# EAGLE design AntennaBoard (EAGLE 6.1)
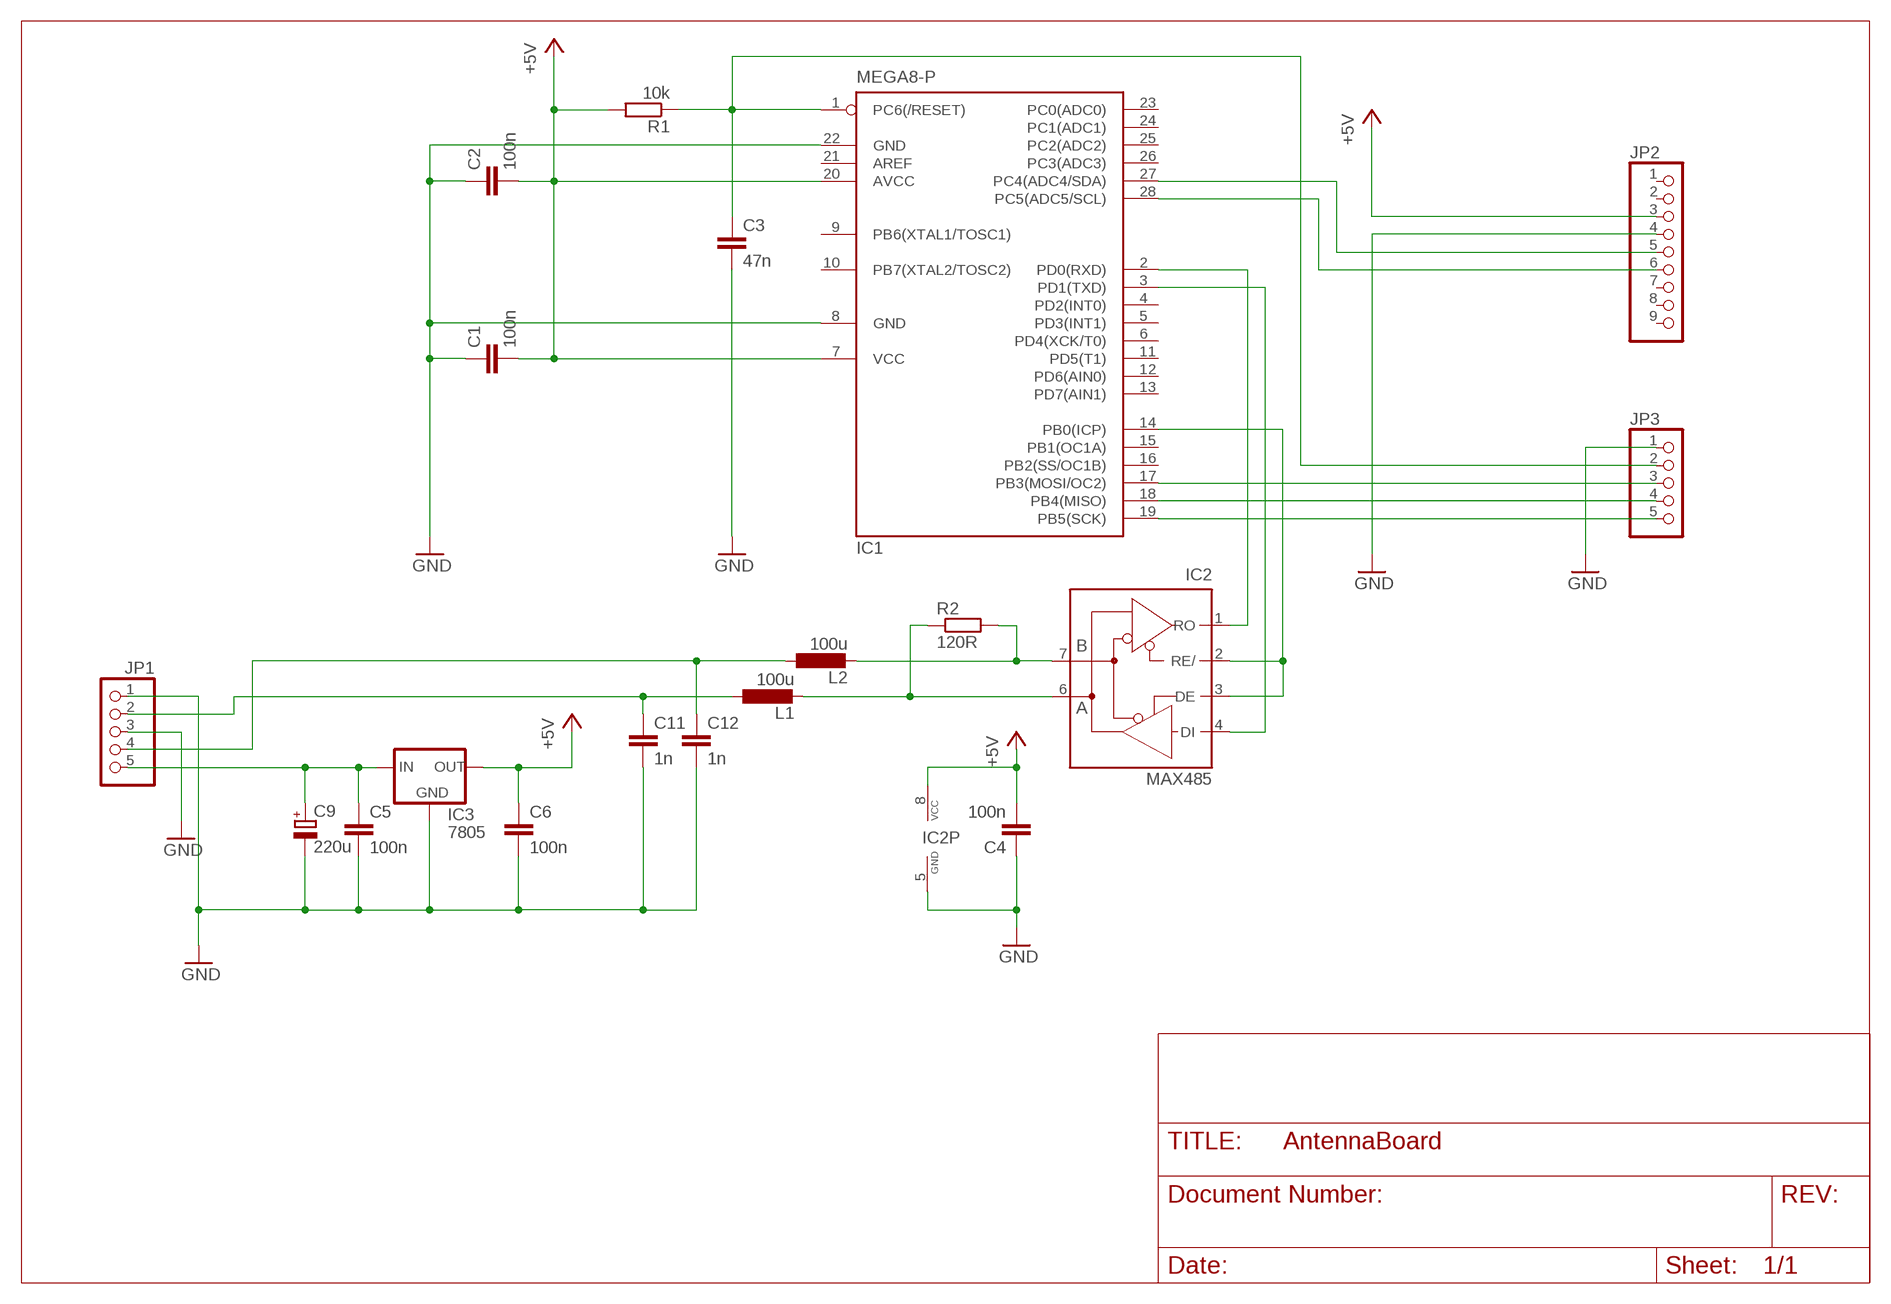
[diagram p0: schematic, sheet 1]

## Parts
C1  100n  C-EU050-024X044  [C050-024X044]
C2  100n  C-EU050-024X044  [C050-024X044]
C3  47n  C-EU050-024X044  [C050-024X044]
C4  100n  C-EU050-024X044  [C050-024X044]
C5  100n  C-EU050-024X044  [C050-024X044]
C6  100n  C-EU050-024X044  [C050-024X044]
C9  220u  CPOL-EUE5-10.5  [E5-10,5]
C11  1n  C-EU025-024X044  [C025-024X044]
C12  1n  C-EU025-024X044  [C025-024X044]
IC1  MEGA8-P  [DIL28-3]
IC2  MAX485  MAX481CPA  [DIL08]
IC3  7805  78XXL  [78XXL]
JP1  PINHD-1X5/90  [1X05/90]
JP2  PINHD-1X9  [1X09]
JP3  PINHD-1X5  [1X05]
L1  100u  L-EU0207/12  [0207/12]
L2  100u  L-EU0207/12  [0207/12]
R1  10k  R-EU_0207/10  [0207/10]
R2  120R  R-EU_0207/10  [0207/10]

## Nets
+5V: C1.2 C2.2 C4.2 C6.1 IC1.7(VCC) IC1.20(AVCC) IC2.8(VCC) IC3.OUT JP2.3 R1.2
GND: C1.1 C2.1 C3.2 C4.1 C5.2 C6.2 C9.- C11.2 C12.2 IC1.8(GND) IC1.22(GND) IC2.5(GND) IC3.GND JP1.1 JP1.3 JP2.4 JP3.1
N$1: C5.1 C9.+ IC3.IN JP1.5
N$2: IC2.6(A) L1.2 R2.1
N$3: C12.1 JP1.4 L2.1
N$4: IC1.28(PC5(ADC5/SCL)) JP2.6
N$5: C3.1 IC1.1(PC6(/RESET)) JP3.2 R1.1
N$6: IC1.27(PC4(ADC4/SDA)) JP2.5
N$7: IC1.14(PB0(ICP)) IC2.2(RE/) IC2.3(DE)
N$8: IC1.2(PD0(RXD)) IC2.1(RO)
N$9: IC1.3(PD1(TXD)) IC2.4(DI)
N$10: IC2.7(B) L2.2 R2.2
N$11: C11.1 JP1.2 L1.1
N$13: IC1.17(PB3(MOSI/OC2)) JP3.3
N$14: IC1.18(PB4(MISO)) JP3.4
N$15: IC1.19(PB5(SCK)) JP3.5
Unconnected: IC1.4(PD2(INT0)) IC1.5(PD3(INT1)) IC1.6(PD4(XCK/T0)) IC1.9(PB6(XTAL1/TOSC1)) IC1.10(PB7(XTAL2/TOSC2)) IC1.11(PD5(T1)) IC1.12(PD6(AIN0)) IC1.13(PD7(AIN1)) IC1.15(PB1(OC1A)) IC1.16(PB2(SS/OC1B)) IC1.21(AREF) IC1.23(PC0(ADC0)) IC1.24(PC1(ADC1)) IC1.25(PC2(ADC2)) IC1.26(PC3(ADC3)) JP2.1 JP2.2 JP2.7 JP2.8 JP2.9

## Library data of the parts
C1-C6 C11 C12 = rcl:C-EU: CAPACITOR, European symbol
C9 = rcl:CPOL-EU: POLARIZED CAPACITOR, European symbol
IC1 = atmel:MEGA8-P: MICROCONTROLLER 8 Kbytes FLASH, 1 kbytes SRAM, 512 bytes EEPROM, USART, 4-channel 10 bit ADC, 2-channel 8 bit ADC Pin compatible with Atmega48, ATMega88, ATMega168 Source: avr.lbr; OC_FARNELL: unknown; OC_NEWARK: unknown
IC2 = maxim:MAX481CPA: RS485 TRANSEIVER; MPN: MAX481CPA+; OC_FARNELL: unknown; OC_NEWARK: 99K3445
IC3 = v-reg:78XXL: VOLTAGE REGULATOR
JP1 JP3 = pinhead:PINHD-1X5: PIN HEADER
JP2 = pinhead:PINHD-1X9: PIN HEADER
L1 L2 = rcl:L-EU: INDUCTOR, European symbol
R1 R2 = rcl:R-EU_: RESISTOR, European symbol

## Board
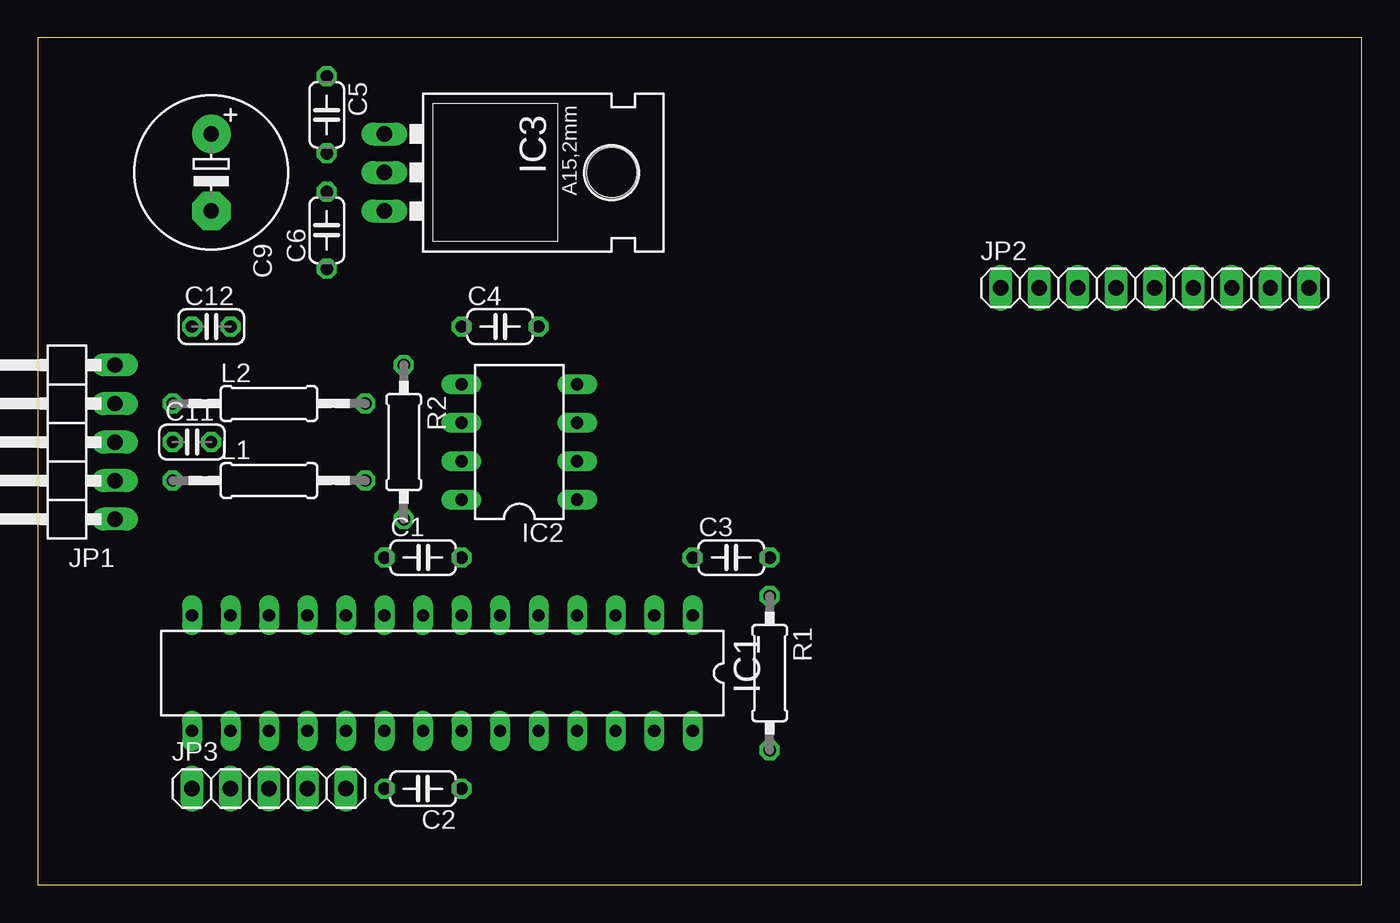
[diagram p1: board, top side]
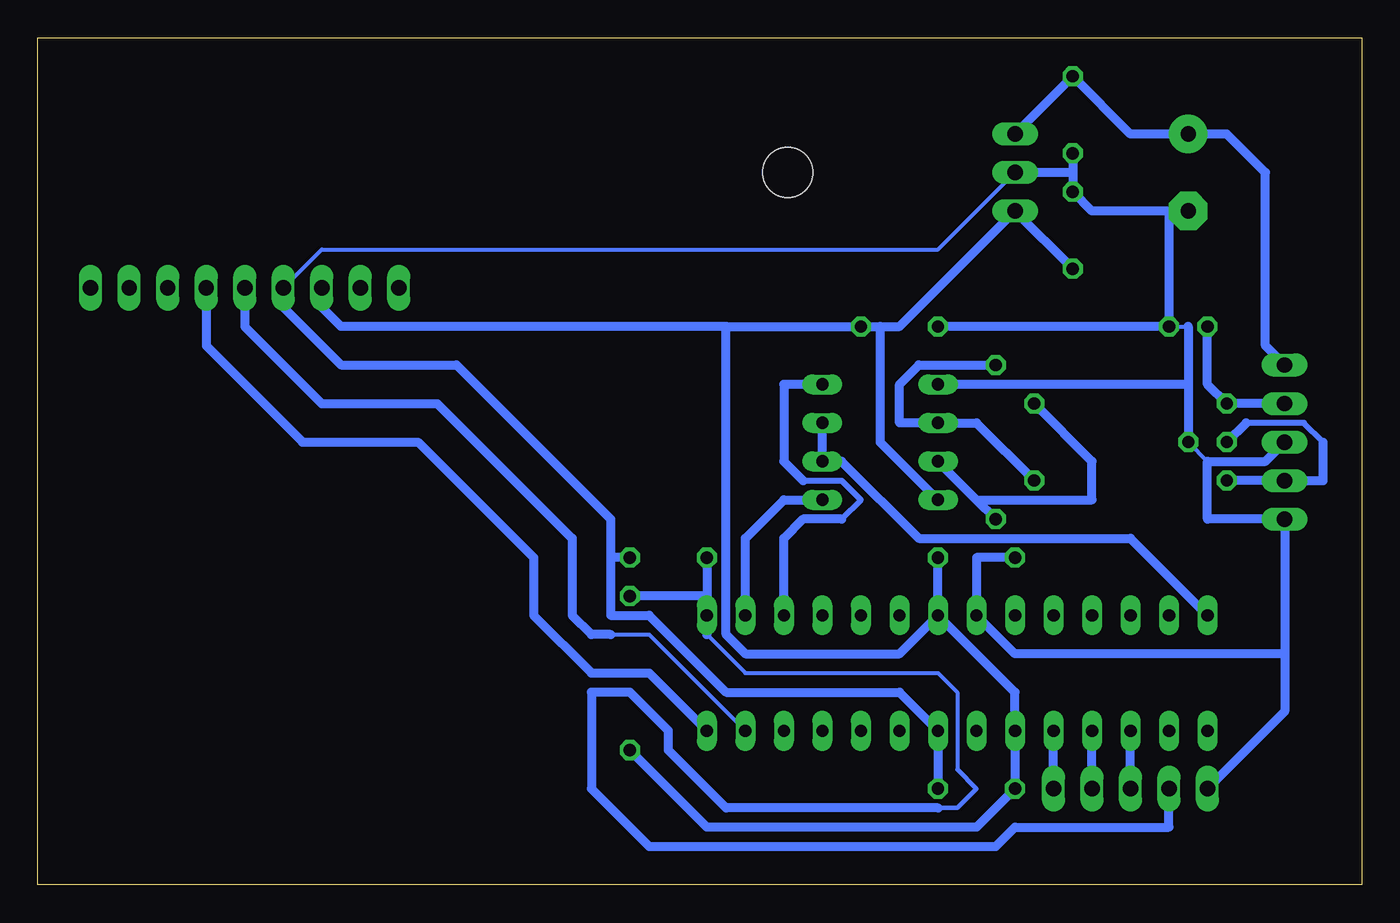
[diagram p2: board, bottom side, seen from below]

Size 87.3 x 55.87 mm. Coordinates in mm from the lower left corner, seen from the top.
Outline: 0,0 87.3,0 87.3,55.87 0,55.87 0,0
Copper layers (1*16): Top 0.035mm / dielectric 1.5mm / Bottom 0.035mm
Design rules: minimum track width 10mil, minimum drill 24mil, track to track 8mil, track to pad 8mil, pad to pad 8mil, via to via 8mil, smd to smd 8mil, copper to edge 40mil, drill to drill 8mil, minimum pad ring 10mil, minimum via ring 8mil, stop-mask expansion 4mil, vias tented up to drill 0mil, thermal gap 10mil

### Footprints (pad centres in the part's own frame; a part is rotated, then mirrored left to right if it is on the bottom)
C050-024X044 = drill 0.813 octagon: 1 -2.54,0; 2 2.54,0
E5-10,5 = drill 1.016 pad 2.54: + -2.54,0 | drill 1.016 pad 2.54 octagon: - 2.54,0
C025-024X044 = drill 0.813 octagon: 1 -1.27,0; 2 1.27,0
DIL28-3 = drill 0.813 long: 1 -16.51,-3.81; 2 -13.97,-3.81; 3 -11.43,-3.81; 4 -8.89,-3.81; 5 -6.35,-3.81; 6 -3.81,-3.81; 7 -1.27,-3.81; 8 1.27,-3.81; 9 3.81,-3.81; 10 6.35,-3.81; 11 8.89,-3.81; 12 11.43,-3.81; 13 13.97,-3.81; 14 16.51,-3.81; 15 16.51,3.81; 16 13.97,3.81; 17 11.43,3.81; 18 8.89,3.81; 19 6.35,3.81; 20 3.81,3.81; 21 1.27,3.81; 22 -1.27,3.81; 23 -3.81,3.81; 24 -6.35,3.81; 25 -8.89,3.81; 26 -11.43,3.81; 27 -13.97,3.81; 28 -16.51,3.81
DIL08 = drill 0.813 long: 1 -3.81,-3.81; 2 -1.27,-3.81; 3 1.27,-3.81; 4 3.81,-3.81; 5 3.81,3.81; 6 1.27,3.81; 7 -1.27,3.81; 8 -3.81,3.81
78XXL = drill 1.016 long: GND 0,-3.81; IN -2.54,-3.81; OUT 2.54,-3.81 | hole 3.302: 0,11.176
1X05/90 = drill 1.016 long: 1 -5.08,-3.81; 2 -2.54,-3.81; 3 0,-3.81; 4 2.54,-3.81; 5 5.08,-3.81
1X09 = drill 1.016 long: 1 -10.16,0; 2 -7.62,0; 3 -5.08,0; 4 -2.54,0; 5 0,0; 6 2.54,0; 7 5.08,0; 8 7.62,0; 9 10.16,0
1X05 = drill 1.016 long: 1 -5.08,0; 2 -2.54,0; 3 0,0; 4 2.54,0; 5 5.08,0
0207/12 = drill 0.813 octagon: 1 -6.35,0; 2 6.35,0
0207/10 = drill 0.813 octagon: 1 -5.08,0; 2 5.08,0

### Placement (x,y rotation side)
C1  25.4,21.59 0 top
C2  25.4,6.35 180 top
C3  45.72,21.59 0 top
C4  30.48,36.83 0 top
C5  19.05,50.8 270 top
C6  19.05,43.18 90 top
C9  11.43,46.99 270 top
C11  10.16,29.21 0 top
C12  11.43,36.83 0 top
IC1  26.67,13.97 180 top
IC2  31.75,29.21 90 top
IC3  26.67,46.99 270 top
JP1  1.27,29.21 90 top
JP2  73.66,39.37 0 top
JP3  15.24,6.35 0 top
L1  15.24,26.67 0 top
L2  15.24,31.75 0 top
R1  48.26,13.97 270 top
R2  24.13,29.21 270 top

### Tracks (layer width: path | path; a pad name or v marks a point on that pad's centre or on a via)
+5V
  Bottom 0.61: R1.2 43.18,3.81 25.4,3.81 C2.2 IC1.20 22.86,12.7 IC1.7 | 41.91,36.83 67.31,36.83 68.58,38.1 JP2.3 | IC1.7 30.48,15.24 40.64,15.24 41.91,16.51 41.91,36.83 | IC1.7 C1.2 | C6.1 IC3.OUT 30.48,36.83 31.75,36.83 | 31.75,36.83 C4.2 41.91,36.83 | IC2.8 31.75,29.21 31.75,36.83
GND
  Bottom 0.254: IC3.GND 27.94,41.91 68.58,41.91 JP2.4 | C12.2 11.43,36.83 | C11.2 10.16,27.94
  Bottom 0.61: 12.7,44.45 C12.2 C4.1 | C9.- 12.7,44.45 | JP2.4 71.12,38.1 67.31,34.29 59.69,34.29 49.53,24.13 49.53,21.59 | 49.53,21.59 49.53,17.78 46.99,17.78 41.91,12.7 30.48,12.7 IC1.22 C2.1 | C3.2 49.53,21.59 | C1.1 25.4,21.59 IC1.8 22.86,15.24 5.08,15.24 | C5.2 19.05,46.99 | 19.05,46.99 C6.2 17.78,44.45 12.7,44.45 | 19.05,46.99 IC3.GND | JP3.1 5.08,11.43 5.08,15.24 | 5.08,15.24 JP1.1 10.16,24.13 10.16,27.94 6.35,27.94 JP1.3 | 11.43,36.83 11.43,33.02 | 11.43,33.02 C11.2 | 11.43,33.02 IC2.5
N$1
  Bottom 0.61: IC3.IN C5.1 15.24,49.53 C9.+ 8.89,49.53 6.35,46.99 6.35,35.56 JP1.5
N$2
  Bottom 0.61: L1.2 25.4,30.48 IC2.6 30.48,30.48 30.48,33.02 29.21,34.29 R2.1
N$3
  Bottom 0.61: JP1.4 L2.1 10.16,33.02 C12.1
N$4
  Bottom 0.61: JP2.6 76.2,35.56 69.85,29.21 62.23,29.21 54.61,21.59 54.61,17.78 50.8,13.97 46.99,13.97 IC1.28
N$5
  Bottom 0.254: 43.18,19.05 IC1.1 | 43.18,16.51 40.64,13.97 27.94,13.97 26.67,12.7 26.67,7.62
  Bottom 0.305: 27.94,5.08 26.67,5.08 25.4,6.35 26.67,7.62
  Bottom 0.61: C3.1 43.18,19.05 R1.1 | IC1.1 43.18,16.51 | 27.94,5.08 41.91,5.08 45.72,8.89 45.72,10.16 48.26,12.7 50.8,12.7 50.8,6.35 46.99,2.54 24.13,2.54 22.86,3.81 12.7,3.81 JP3.2
N$6
  Bottom 0.254: IC1.27 46.99,16.51 49.53,16.51
  Bottom 0.61: JP2.5 73.66,36.83 68.58,31.75 60.96,31.75 52.07,22.86 52.07,17.78 50.8,16.51 49.53,16.51
N$7
  Bottom 0.254: IC2.2 34.29,27.94
  Bottom 0.61: IC2.2 IC2.3 | IC1.14 15.24,22.86 29.21,22.86 34.29,27.94
N$8
  Bottom 0.61: IC1.2 40.64,22.86 38.1,25.4 IC2.1
N$9
  Bottom 0.406: 34.29,24.13 33.02,25.4 34.29,26.67 36.83,26.67
  Bottom 0.61: 34.29,24.13 36.83,24.13 38.1,22.86 IC1.3 | 36.83,26.67 38.1,27.94 38.1,33.02 IC2.4
N$10
  Bottom 0.61: IC2.7 25.4,25.4 | 25.4,25.4 R2.2 | L2.2 17.78,27.94 17.78,25.4 25.4,25.4
N$11
  Bottom 0.406: 7.62,30.48 3.81,30.48 2.54,29.21
  Bottom 0.61: L1.1 JP1.2 2.54,26.67 2.54,29.21 | 7.62,30.48 C11.1
N$13
  Bottom 0.61: JP3.3 IC1.17
N$14
  Bottom 0.61: JP3.4 IC1.18
N$15
  Bottom 0.61: JP3.5 IC1.19